# EasyEDA schematic gpr-backplane-schematic-v1.json
TITLE: GPR Backplane; REV: v1; Date: 2024-05-11; Sheet: 1/1; Drawn By: Fabian Schuiki; Company: Your Company
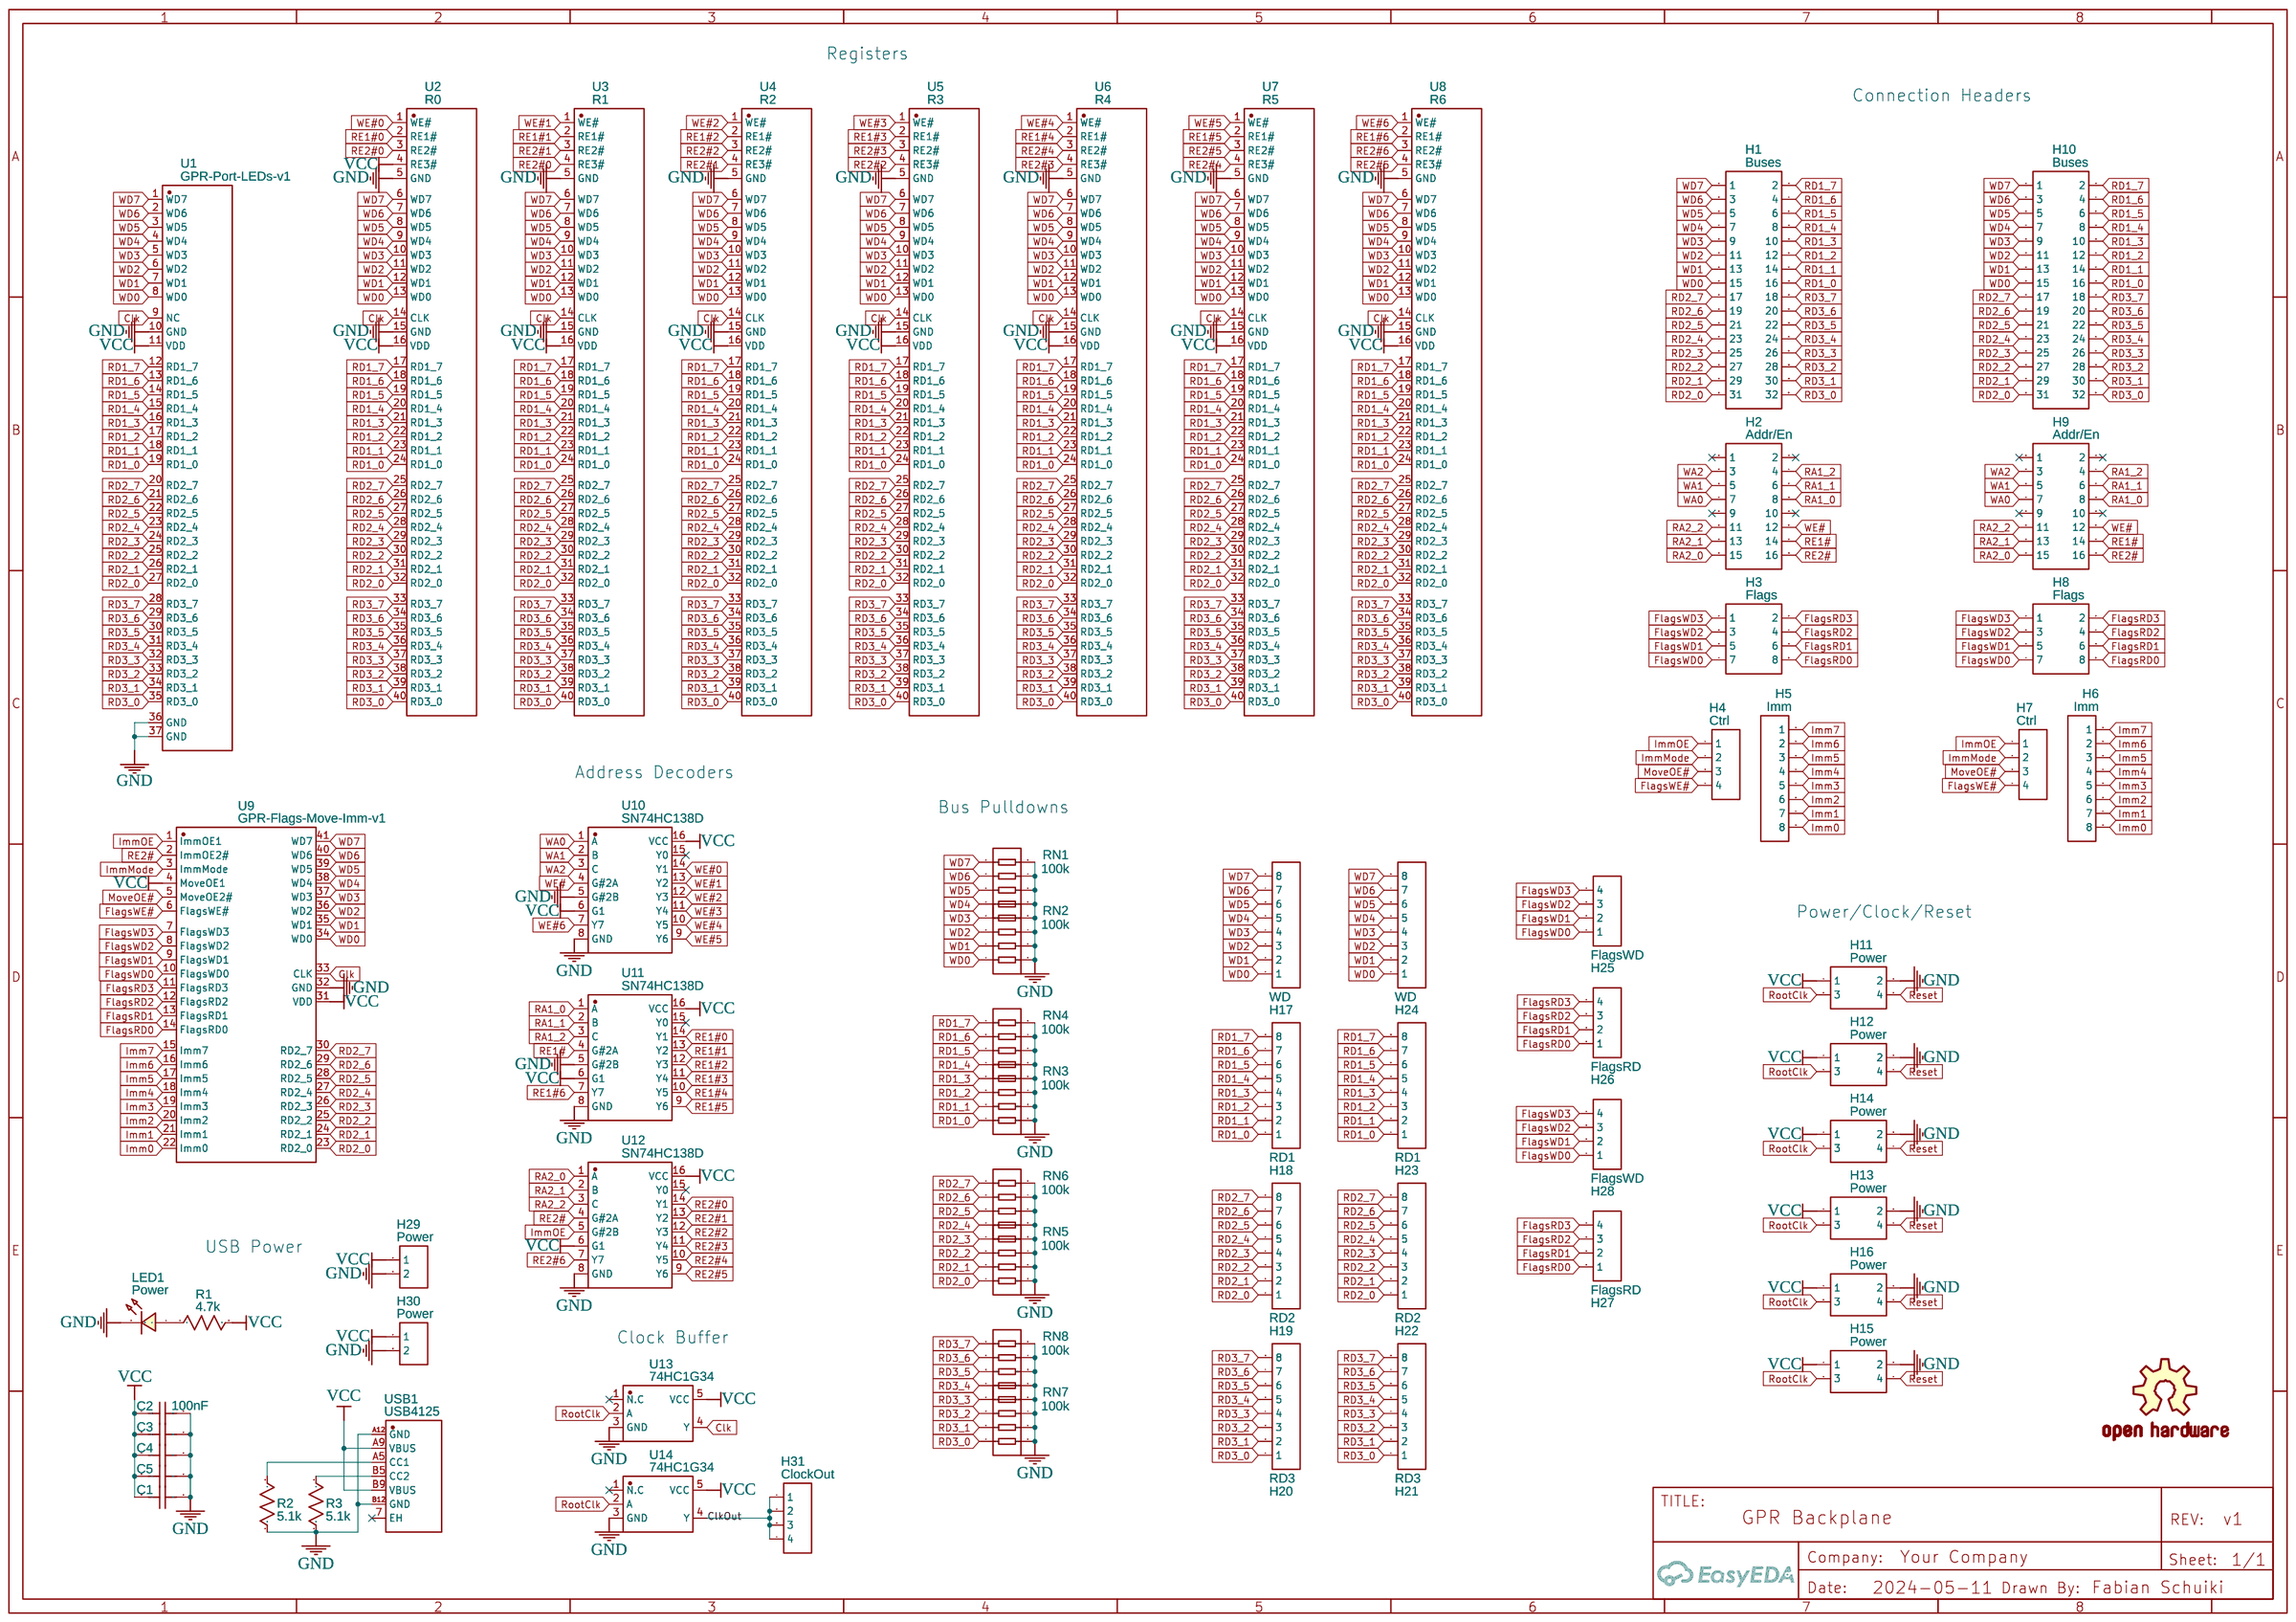
[diagram p0: schematic sheet]

## Parts
C1  100nF  [C0603]
C2  100nF  [C0603]
C3  100nF  [C0603]
C4  100nF  [C0603]
C5  100nF  [C0603]
H1  Buses  [HDR-F-2.54_2X16]
H2  Addr/En  [HDR-F-2.54_2X8]
H3  Flags  [HDR-F-2.54_2X4]
H4  Ctrl  [HDR-F-2.54_1X4]
H5  Imm  [HDR-F-2.54_1X8]
H6  Imm  [HDR-F-2.54_1X8]
H7  Ctrl  [HDR-F-2.54_1X4]
H8  Flags  [HDR-F-2.54_2X4]
H9  Addr/En  [HDR-F-2.54_2X8]
H10  Buses  [HDR-F-2.54_2X16]
H11  Power  [HDR-F-2.54_2X2]
H12  Power  [HDR-F-2.54_2X2]
H13  Power  [HDR-F-2.54_2X2]
H14  Power  [HDR-F-2.54_2X2]
H15  Power  [HDR-F-2.54_2X2]
H16  Power  [HDR-F-2.54_2X2]
H17  WD  [HDR-F-2.54_1X8]
H18  RD1  [HDR-F-2.54_1X8]
H19  RD2  [HDR-F-2.54_1X8]
H20  RD3  [HDR-F-2.54_1X8]
H21  RD3  [HDR-F-2.54_1X8]
H22  RD2  [HDR-F-2.54_1X8]
H23  RD1  [HDR-F-2.54_1X8]
H24  WD  [HDR-F-2.54_1X8]
H25  FlagsWD  [HDR-F-2.54_1X4]
H26  FlagsRD  [HDR-F-2.54_1X4]
H27  FlagsRD  [HDR-F-2.54_1X4]
H28  FlagsWD  [HDR-F-2.54_1X4]
H29  Power  [HDR-F-2.54_1X2]
H30  Power  [HDR-F-2.54_1X2]
H31  ClockOut  [HDR-F-2.54_1X4]
LED1  Power  [LED0805_BLUE]
LOGO1  ChannelLogo  [CHANNEL_LOGO]
LOGO2  OSHW-LOGOL  [OSHW-LOGO-L]
R1  4.7k  [R0603]
R2  5.1k  [R0603]
R3  5.1k  [R0603]
RN1  100k  [RES-ARRAY-SMD_0603-8P-L3.2-W1.6-BL]
RN2  100k  [RES-ARRAY-SMD_0603-8P-L3.2-W1.6-BL]
RN3  100k  [RES-ARRAY-SMD_0603-8P-L3.2-W1.6-BL]
RN4  100k  [RES-ARRAY-SMD_0603-8P-L3.2-W1.6-BL]
RN5  100k  [RES-ARRAY-SMD_0603-8P-L3.2-W1.6-BL]
RN6  100k  [RES-ARRAY-SMD_0603-8P-L3.2-W1.6-BL]
RN7  100k  [RES-ARRAY-SMD_0603-8P-L3.2-W1.6-BL]
RN8  100k  [RES-ARRAY-SMD_0603-8P-L3.2-W1.6-BL]
U1  GPR-Port-LEDs-v1  [MOD-GPR-PORT-LEDS-V1]
U2  R0  [MOD-GPR-V1]
U3  R1  [MOD-GPR-V1]
U4  R2  [MOD-GPR-V1]
U5  R3  [MOD-GPR-V1]
U6  R4  [MOD-GPR-V1]
U7  R5  [MOD-GPR-V1]
U8  R6  [MOD-GPR-V1]
U9  GPR-Flags-Move-Imm-v1  [MOD-GPR-FLAGS-MOVE-IMM-V1]
U10  SN74HC138D  [SOIC-16_L9.9-W3.9-P1.27-LS6.0-BL]
U11  SN74HC138D  [SOIC-16_L9.9-W3.9-P1.27-LS6.0-BL]
U12  SN74HC138D  [SOIC-16_L9.9-W3.9-P1.27-LS6.0-BL]
U13  74HC1G34  [SOT-23-5_L2.9-W1.6-P0.95-LS2.8-BR]
U14  74HC1G34  [SOT-23-5_L2.9-W1.6-P0.95-LS2.8-BR]
USB1  USB4125  [TYPE-C-SMD_TYPE-C-6P_USB4125-GF-A-0190]

## Library data of the parts
C1-C5 = C_0603_US: Contributor: LCEDA_Lib
H1 H10 = HDR-F-2.54_2x16: Supplier Part: C124382; Supplier: LCSC; Contributor: LCEDA_Lib
H2 H9 = HDR-F-2.54_2x8: Supplier Part: C30734; Supplier: LCSC; Contributor: LCEDA_Lib
H3 H8 = HDR-F-2.54_2x4: Supplier Part: C239344; Supplier: LCSC; Contributor: LCEDA_Lib
H4 H7 H25-H28 H31 = HDR-F-2.54_1x4: Supplier Part: C225501; Supplier: LCSC; Contributor: LCEDA_Lib
H5 H6 H17-H24 = HDR-F-2.54_1x8: Supplier Part: C225505; Supplier: LCSC; Contributor: LCEDA_Lib
H11-H16 = HDR-F-2.54_2x2: Supplier Part: C239342; Supplier: LCSC; Contributor: LCEDA_Lib
H29 H30 = HDR-F-2.54_1x2: Supplier Part: C49661; Supplier: LCSC; Contributor: LCEDA_Lib
LED1 = LED-0805_B: Manufacturer: 方舟 ARKLED; Manufacturer Part: D-B080508B1-KS2; Supplier Part: C108412; Contributor: LCEDA_Lib
LOGO1 = ChannelLogo: Contributor: fabian_8885
LOGO2 = OSHW-LOGOL: Contributor: jrmatos
R1-R3 = R_0603_US: Contributor: LCEDA_Lib
RN1-RN8 = 4D03WGJ0753T5E: Supplier: LCSC; Supplier Part: C425056; Manufacturer: UNI-ROYAL(Uniroyal Elec); Resistance (Ohms): 75K; Contributor: LCSC; JLCPCB Part Class: Extended Part
U1 = GPR-Port-LEDs-v1: Contributor: Fabian Schuiki
U2-U8 = GPR-v1: Contributor: Fabian Schuiki
U9 = GPR-Flags-Move-Imm-v1: Contributor: Fabian Schuiki
U10-U12 = SN74HC138D: Contributor: LCSC; Supplier: LCSC; Supplier Part: C1523704; Manufacturer: TI(德州仪器); JLCPCB Part Class: Extended Part
U13 U14 = SN74LVC1G34DBVRG4: Contributor: LCSC; Supplier: LCSC; Supplier Part: C2868957; Manufacturer: TI(德州仪器)
USB1 = 00401-UCAF001-X: Supplier: LCSC; Supplier Part: C3148196; Manufacturer: MINTRON(明硕); Contributor: lcsc; JLCPCB Part Class: Extended Part

## Nets
GND: C1.2 C2.2 C3.2 C4.2 C5.2 H11.2 H12.2 H13.2 H14.2 H15.2 H16.2 H29.2 H30.2 LED1.2 R2.1 R3.1 RN1.5 RN1.6 RN1.7 RN1.8 RN2.5 RN2.6 RN2.7 RN2.8 RN3.5 RN3.6 RN3.7 RN3.8 RN4.5 RN4.6 RN4.7 RN4.8 RN5.5 RN5.6 RN5.7 RN5.8 RN6.5 RN6.6 RN6.7 RN6.8 RN7.5 RN7.6 RN7.7 RN7.8 RN8.5 RN8.6 RN8.7 RN8.8 U1.10(GND) U1.36(GND) U1.37(GND) U2.5(GND) U2.15(GND) U3.5(GND) U3.15(GND) U4.5(GND) U4.15(GND) U5.5(GND) U5.15(GND) U6.5(GND) U6.15(GND) U7.5(GND) U7.15(GND) U8.5(GND) U8.15(GND) U9.32(GND) U10.5(G#2B) U10.8(GND) U11.5(G#2B) U11.8(GND) U12.8(GND) U13.3(GND) U14.3(GND) USB1.A12(GND) USB1.B12(GND)
VCC: C1.1 C2.1 C3.1 C4.1 C5.1 H11.1 H12.1 H13.1 H14.1 H15.1 H16.1 H29.1 H30.1 R1.2 U1.11(VDD) U2.4(RE3#) U2.16(VDD) U3.16(VDD) U4.16(VDD) U5.16(VDD) U6.16(VDD) U7.16(VDD) U8.16(VDD) U9.4(MoveOE1) U9.31(VDD) U10.6(G1) U10.16(VCC) U11.6(G1) U11.16(VCC) U12.6(G1) U12.16(VCC) U13.5(VCC) U14.5(VCC) USB1.A9(VBUS) USB1.B9(VBUS)
Clk: U1.9(NC) U2.14(CLK) U3.14(CLK) U4.14(CLK) U5.14(CLK) U6.14(CLK) U7.14(CLK) U8.14(CLK) U9.33(CLK) U13.4(Y)
ClkOut: H31.1 H31.2 H31.3 H31.4 U14.4(Y)
FlagsRD0: H3.8 H8.8 H26.1 H27.1 U9.14(FlagsRD0)
FlagsRD1: H3.6 H8.6 H26.2 H27.2 U9.13(FlagsRD1)
FlagsRD2: H3.4 H8.4 H26.3 H27.3 U9.12(FlagsRD2)
FlagsRD3: H3.2 H8.2 H26.4 H27.4 U9.11(FlagsRD3)
FlagsWD0: H3.7 H8.7 H25.1 H28.1 U9.10(FlagsWD0)
FlagsWD1: H3.5 H8.5 H25.2 H28.2 U9.9(FlagsWD1)
FlagsWD2: H3.3 H8.3 H25.3 H28.3 U9.8(FlagsWD2)
FlagsWD3: H3.1 H8.1 H25.4 H28.4 U9.7(FlagsWD3)
FlagsWE#: H4.4 H7.4 U9.6(FlagsWE#)
Imm0: H5.8 H6.8 U9.22(Imm0)
Imm1: H5.7 H6.7 U9.21(Imm1)
Imm2: H5.6 H6.6 U9.20(Imm2)
Imm3: H5.5 H6.5 U9.19(Imm3)
Imm4: H5.4 H6.4 U9.18(Imm4)
Imm5: H5.3 H6.3 U9.17(Imm5)
Imm6: H5.2 H6.2 U9.16(Imm6)
Imm7: H5.1 H6.1 U9.15(Imm7)
ImmMode: H4.2 H7.2 U9.3(ImmMode)
ImmOE: H4.1 H7.1 U9.1(ImmOE1) U12.5(G#2B)
MoveOE#: H4.3 H7.3 U9.5(MoveOE2#)
RA1_0: H2.8 H9.8 U11.1(A)
RA1_1: H2.6 H9.6 U11.2(B)
RA1_2: H2.4 H9.4 U11.3(C)
RA2_0: H2.15 H9.15 U12.1(A)
RA2_1: H2.13 H9.13 U12.2(B)
RA2_2: H2.11 H9.11 U12.3(C)
RD1_0: H1.16 H10.16 H18.1 H23.1 RN3.4 U1.19(RD1_0) U2.24(RD1_0) U3.24(RD1_0) U4.24(RD1_0) U5.24(RD1_0) U6.24(RD1_0) U7.24(RD1_0) U8.24(RD1_0)
RD1_1: H1.14 H10.14 H18.2 H23.2 RN3.3 U1.18(RD1_1) U2.23(RD1_1) U3.23(RD1_1) U4.23(RD1_1) U5.23(RD1_1) U6.23(RD1_1) U7.23(RD1_1) U8.23(RD1_1)
RD1_2: H1.12 H10.12 H18.3 H23.3 RN3.2 U1.17(RD1_2) U2.22(RD1_2) U3.22(RD1_2) U4.22(RD1_2) U5.22(RD1_2) U6.22(RD1_2) U7.22(RD1_2) U8.22(RD1_2)
RD1_3: H1.10 H10.10 H18.4 H23.4 RN3.1 U1.16(RD1_3) U2.21(RD1_3) U3.21(RD1_3) U4.21(RD1_3) U5.21(RD1_3) U6.21(RD1_3) U7.21(RD1_3) U8.21(RD1_3)
RD1_4: H1.8 H10.8 H18.5 H23.5 RN4.4 U1.15(RD1_4) U2.20(RD1_4) U3.20(RD1_4) U4.20(RD1_4) U5.20(RD1_4) U6.20(RD1_4) U7.20(RD1_4) U8.20(RD1_4)
RD1_5: H1.6 H10.6 H18.6 H23.6 RN4.3 U1.14(RD1_5) U2.19(RD1_5) U3.19(RD1_5) U4.19(RD1_5) U5.19(RD1_5) U6.19(RD1_5) U7.19(RD1_5) U8.19(RD1_5)
RD1_6: H1.4 H10.4 H18.7 H23.7 RN4.2 U1.13(RD1_6) U2.18(RD1_6) U3.18(RD1_6) U4.18(RD1_6) U5.18(RD1_6) U6.18(RD1_6) U7.18(RD1_6) U8.18(RD1_6)
RD1_7: H1.2 H10.2 H18.8 H23.8 RN4.1 U1.12(RD1_7) U2.17(RD1_7) U3.17(RD1_7) U4.17(RD1_7) U5.17(RD1_7) U6.17(RD1_7) U7.17(RD1_7) U8.17(RD1_7)
RD2_0: H1.31 H10.31 H19.1 H22.1 RN5.4 U1.27(RD2_0) U2.32(RD2_0) U3.32(RD2_0) U4.32(RD2_0) U5.32(RD2_0) U6.32(RD2_0) U7.32(RD2_0) U8.32(RD2_0) U9.23(RD2_0)
RD2_1: H1.29 H10.29 H19.2 H22.2 RN5.3 U1.26(RD2_1) U2.31(RD2_1) U3.31(RD2_1) U4.31(RD2_1) U5.31(RD2_1) U6.31(RD2_1) U7.31(RD2_1) U8.31(RD2_1) U9.24(RD2_1)
RD2_2: H1.27 H10.27 H19.3 H22.3 RN5.2 U1.25(RD2_2) U2.30(RD2_2) U3.30(RD2_2) U4.30(RD2_2) U5.30(RD2_2) U6.30(RD2_2) U7.30(RD2_2) U8.30(RD2_2) U9.25(RD2_2)
RD2_3: H1.25 H10.25 H19.4 H22.4 RN5.1 U1.24(RD2_3) U2.29(RD2_3) U3.29(RD2_3) U4.29(RD2_3) U5.29(RD2_3) U6.29(RD2_3) U7.29(RD2_3) U8.29(RD2_3) U9.26(RD2_3)
RD2_4: H1.23 H10.23 H19.5 H22.5 RN6.4 U1.23(RD2_4) U2.28(RD2_4) U3.28(RD2_4) U4.28(RD2_4) U5.28(RD2_4) U6.28(RD2_4) U7.28(RD2_4) U8.28(RD2_4) U9.27(RD2_4)
RD2_5: H1.21 H10.21 H19.6 H22.6 RN6.3 U1.22(RD2_5) U2.27(RD2_5) U3.27(RD2_5) U4.27(RD2_5) U5.27(RD2_5) U6.27(RD2_5) U7.27(RD2_5) U8.27(RD2_5) U9.28(RD2_5)
RD2_6: H1.19 H10.19 H19.7 H22.7 RN6.2 U1.21(RD2_6) U2.26(RD2_6) U3.26(RD2_6) U4.26(RD2_6) U5.26(RD2_6) U6.26(RD2_6) U7.26(RD2_6) U8.26(RD2_6) U9.29(RD2_6)
RD2_7: H1.17 H10.17 H19.8 H22.8 RN6.1 U1.20(RD2_7) U2.25(RD2_7) U3.25(RD2_7) U4.25(RD2_7) U5.25(RD2_7) U6.25(RD2_7) U7.25(RD2_7) U8.25(RD2_7) U9.30(RD2_7)
RD3_0: H1.32 H10.32 H20.1 H21.1 RN7.4 U1.35(RD3_0) U2.40(RD3_0) U3.40(RD3_0) U4.40(RD3_0) U5.40(RD3_0) U6.40(RD3_0) U7.40(RD3_0) U8.40(RD3_0)
RD3_1: H1.30 H10.30 H20.2 H21.2 RN7.3 U1.34(RD3_1) U2.39(RD3_1) U3.39(RD3_1) U4.39(RD3_1) U5.39(RD3_1) U6.39(RD3_1) U7.39(RD3_1) U8.39(RD3_1)
RD3_2: H1.28 H10.28 H20.3 H21.3 RN7.2 U1.33(RD3_2) U2.38(RD3_2) U3.38(RD3_2) U4.38(RD3_2) U5.38(RD3_2) U6.38(RD3_2) U7.38(RD3_2) U8.38(RD3_2)
RD3_3: H1.26 H10.26 H20.4 H21.4 RN7.1 U1.32(RD3_3) U2.37(RD3_3) U3.37(RD3_3) U4.37(RD3_3) U5.37(RD3_3) U6.37(RD3_3) U7.37(RD3_3) U8.37(RD3_3)
RD3_4: H1.24 H10.24 H20.5 H21.5 RN8.4 U1.31(RD3_4) U2.36(RD3_4) U3.36(RD3_4) U4.36(RD3_4) U5.36(RD3_4) U6.36(RD3_4) U7.36(RD3_4) U8.36(RD3_4)
RD3_5: H1.22 H10.22 H20.6 H21.6 RN8.3 U1.30(RD3_5) U2.35(RD3_5) U3.35(RD3_5) U4.35(RD3_5) U5.35(RD3_5) U6.35(RD3_5) U7.35(RD3_5) U8.35(RD3_5)
RD3_6: H1.20 H10.20 H20.7 H21.7 RN8.2 U1.29(RD3_6) U2.34(RD3_6) U3.34(RD3_6) U4.34(RD3_6) U5.34(RD3_6) U6.34(RD3_6) U7.34(RD3_6) U8.34(RD3_6)
RD3_7: H1.18 H10.18 H20.8 H21.8 RN8.1 U1.28(RD3_7) U2.33(RD3_7) U3.33(RD3_7) U4.33(RD3_7) U5.33(RD3_7) U6.33(RD3_7) U7.33(RD3_7) U8.33(RD3_7)
RE1#: H2.14 H9.14 U11.4(G#2A)
RE1#0: U2.2(RE1#) U11.14(Y1)
RE1#1: U3.2(RE1#) U11.13(Y2)
RE1#2: U4.2(RE1#) U11.12(Y3)
RE1#3: U5.2(RE1#) U11.11(Y4)
RE1#4: U6.2(RE1#) U11.10(Y5)
RE1#5: U7.2(RE1#) U11.9(Y6)
RE1#6: U8.2(RE1#) U11.7(Y7)
RE2#: H2.16 H9.16 U9.2(ImmOE2#) U12.4(G#2A)
RE2#0: U2.3(RE2#) U3.4(RE3#) U12.14(Y1)
RE2#1: U3.3(RE2#) U4.4(RE3#) U12.13(Y2)
RE2#2: U4.3(RE2#) U5.4(RE3#) U12.12(Y3)
RE2#3: U5.3(RE2#) U6.4(RE3#) U12.11(Y4)
RE2#4: U6.3(RE2#) U7.4(RE3#) U12.10(Y5)
RE2#5: U7.3(RE2#) U8.4(RE3#) U12.9(Y6)
RE2#6: U8.3(RE2#) U12.7(Y7)
Reset: H11.4 H12.4 H13.4 H14.4 H15.4 H16.4
RootClk: H11.3 H12.3 H13.3 H14.3 H15.3 H16.3 U13.2(A) U14.2(A)
WA0: H2.7 H9.7 U10.1(A)
WA1: H2.5 H9.5 U10.2(B)
WA2: H2.3 H9.3 U10.3(C)
WD0: H1.15 H10.15 H17.1 H24.1 RN2.4 U1.8(WD0) U2.13(WD0) U3.13(WD0) U4.13(WD0) U5.13(WD0) U6.13(WD0) U7.13(WD0) U8.13(WD0) U9.34(WD0)
WD1: H1.13 H10.13 H17.2 H24.2 RN2.3 U1.7(WD1) U2.12(WD1) U3.12(WD1) U4.12(WD1) U5.12(WD1) U6.12(WD1) U7.12(WD1) U8.12(WD1) U9.35(WD1)
WD2: H1.11 H10.11 H17.3 H24.3 RN2.2 U1.6(WD2) U2.11(WD2) U3.11(WD2) U4.11(WD2) U5.11(WD2) U6.11(WD2) U7.11(WD2) U8.11(WD2) U9.36(WD2)
WD3: H1.9 H10.9 H17.4 H24.4 RN2.1 U1.5(WD3) U2.10(WD3) U3.10(WD3) U4.10(WD3) U5.10(WD3) U6.10(WD3) U7.10(WD3) U8.10(WD3) U9.37(WD3)
WD4: H1.7 H10.7 H17.5 H24.5 RN1.4 U1.4(WD4) U2.9(WD4) U3.9(WD4) U4.9(WD4) U5.9(WD4) U6.9(WD4) U7.9(WD4) U8.9(WD4) U9.38(WD4)
WD5: H1.5 H10.5 H17.6 H24.6 RN1.3 U1.3(WD5) U2.8(WD5) U3.8(WD5) U4.8(WD5) U5.8(WD5) U6.8(WD5) U7.8(WD5) U8.8(WD5) U9.39(WD5)
WD6: H1.3 H10.3 H17.7 H24.7 RN1.2 U1.2(WD6) U2.7(WD6) U3.7(WD6) U4.7(WD6) U5.7(WD6) U6.7(WD6) U7.7(WD6) U8.7(WD6) U9.40(WD6)
WD7: H1.1 H10.1 H17.8 H24.8 RN1.1 U1.1(WD7) U2.6(WD7) U3.6(WD7) U4.6(WD7) U5.6(WD7) U6.6(WD7) U7.6(WD7) U8.6(WD7) U9.41(WD7)
WE#: H2.12 H9.12 U10.4(G#2A)
WE#0: U2.1(WE#) U10.14(Y1)
WE#1: U3.1(WE#) U10.13(Y2)
WE#2: U4.1(WE#) U10.12(Y3)
WE#3: U5.1(WE#) U10.11(Y4)
WE#4: U6.1(WE#) U10.10(Y5)
WE#5: U7.1(WE#) U10.9(Y6)
WE#6: U8.1(WE#) U10.7(Y7)
Net-(LED1-1): LED1.1 R1.1
Net-(R2-2): R2.2 USB1.A5(CC1)
Net-(R3-2): R3.2 USB1.B5(CC2)

Not connected (* = marked no-connect by the designer): H2 1* 2* 9* 10*; H9 1* 2* 9* 10*; U10 15(Y0)*; U11 15(Y0)*; U12 15(Y0)*; U13 1(N.C)*; U14 1(N.C)*; USB1 7(EH)*

## Notes on the sheet
- Registers
- Connection Headers
- Address Decoders
- Bus Pulldowns
- Power/Clock/Reset
- USB Power
- Clock Buffer
